# EAGLE design GBA SP Battery Kit (EAGLE 6.2)
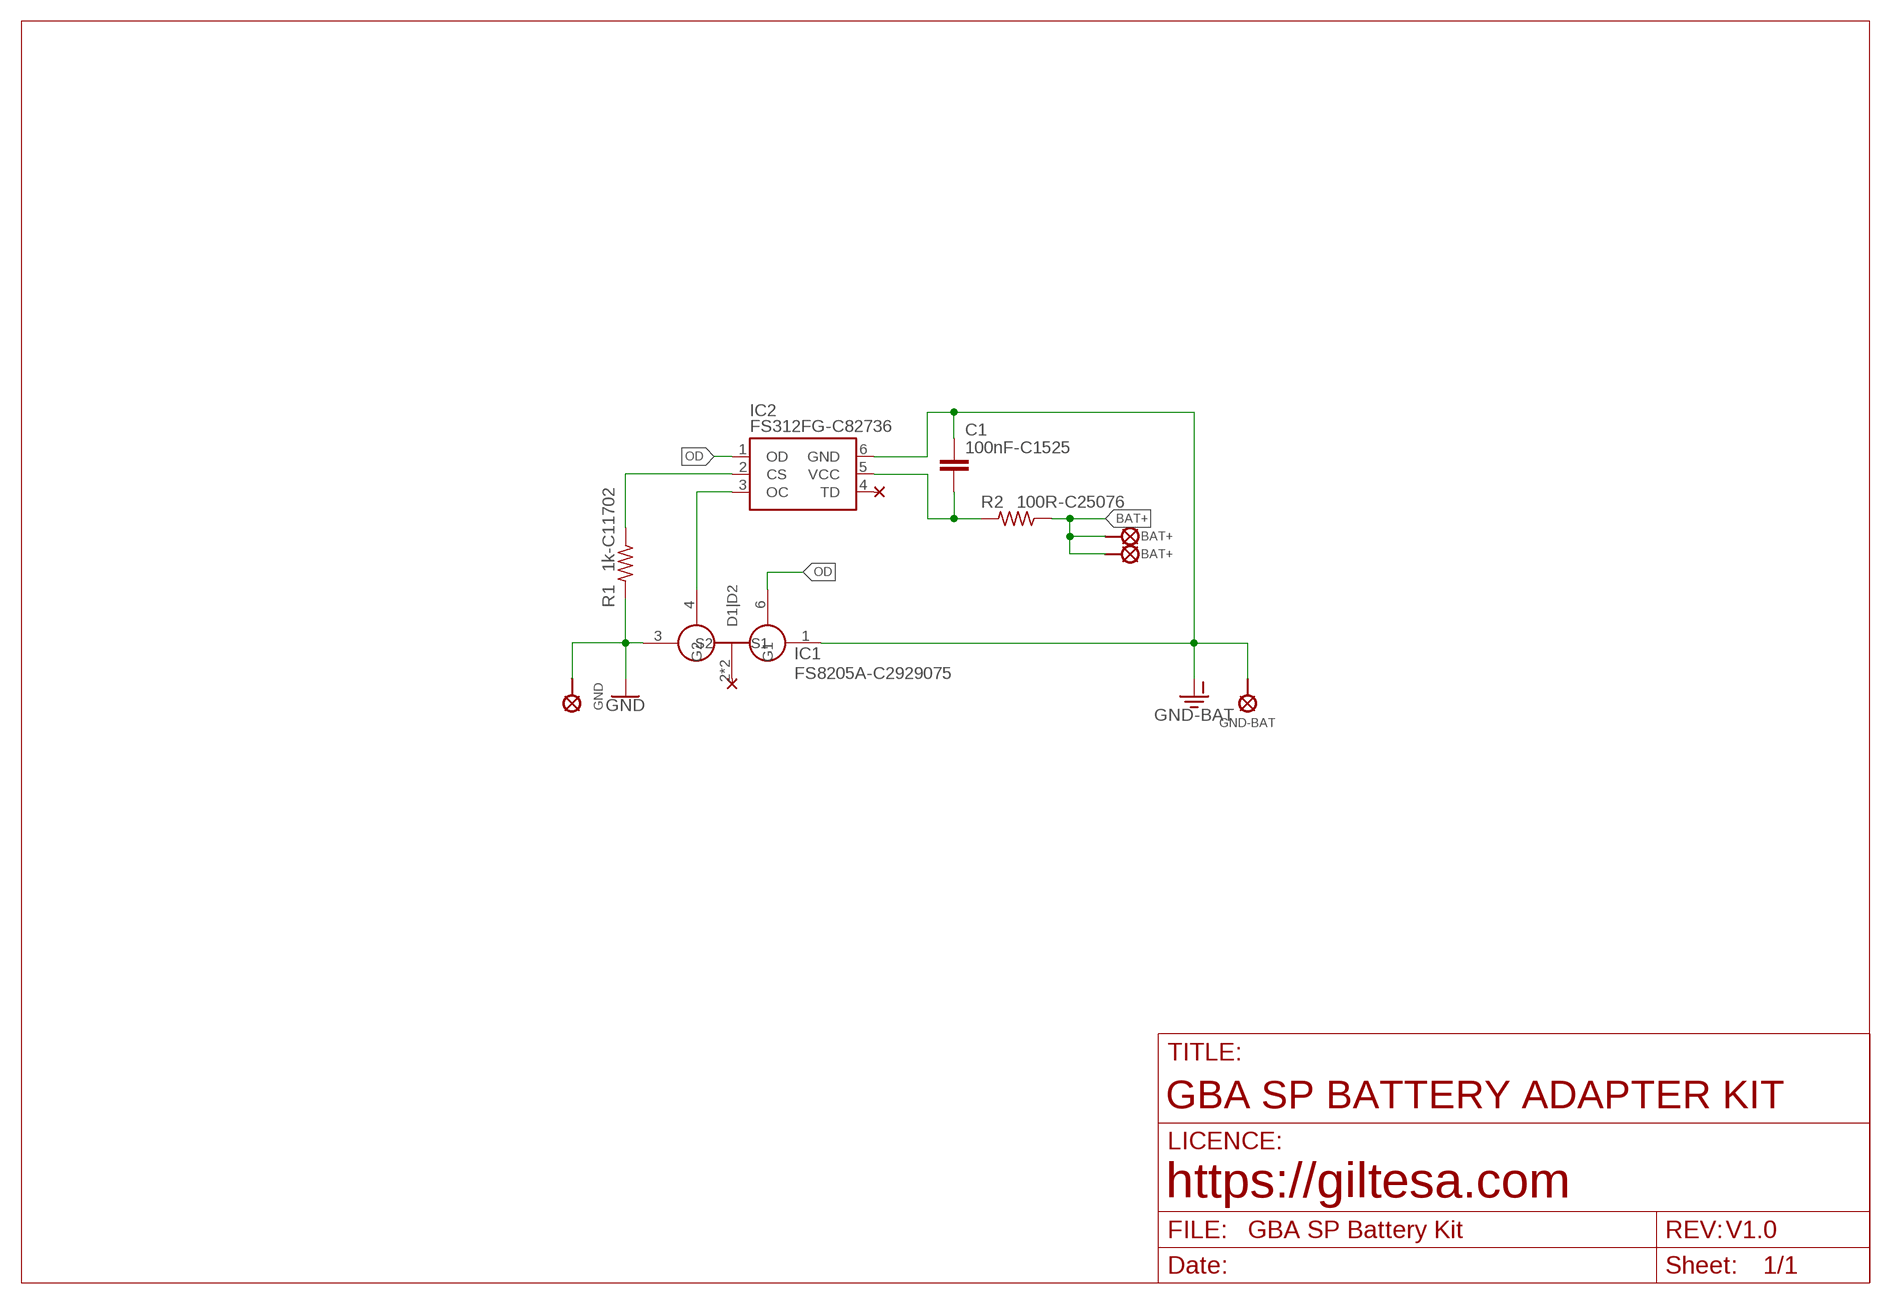
[diagram p0: schematic, sheet 1]

## Parts
C1  100nF-C1525  C0402_S  [C0402_S]
IC1  FS8205A-C2929075  FS8205FS  [SOT-23-6]
IC2  FS312FG-C82736  FS312F-G  [SOT-23-6]
R1  1k-C11702  R0402  [R0402]
R2  100R-C25076  R0402  [R0402]
U$2  BAT+  SOLDER_PADGBASP  [BATTERY_SOLDER_PAD_GBASP]
U$4  GND-BAT  SOLDER_PADGBASP  [BATTERY_SOLDER_PAD_GBASP]
U$5  GND  SOLDER_PADGBASP  [BATTERY_SOLDER_PAD_GBASP]
U$9  BAT+  SOLDER_PADGBASP  [BATTERY_SOLDER_PAD_GBASP]

## Nets
BAT+: R2.1 U$2.1 U$9.1
GND: IC1.3(S2) R1.2 U$5.1
GND-BAT: C1.1 IC1.1(S1) IC2.6(GND) U$4.1
N$1: IC2.2(CS) R1.1
N$2: IC1.4(G2) IC2.3(OC)
OD: IC1.6(G1) IC2.1(OD)
VCC-DW: C1.2 IC2.5(VCC) R2.2
Unconnected: IC1.2(D1|D2) IC1.5(D1|D2) IC2.4(TD)

## Notes on the sheet
- GBA SP BATTERY ADAPTER KIT
- https://giltesa.com
- V1.0

## Library data of the parts
C1 = ,giltesa:C0402
IC1 = ,giltesa:FS8205
IC2 = ,giltesa:FS312F-G
R1 R2 = ,giltesa:R0402
U$2 U$4 U$5 U$9 = ,giltesa:SOLDER_PAD

## Net classes
1 power: width 0.61 mm, drill 0.406 mm, clearance 0.203 mm
2 gnd: width 0.305 mm, drill 0.406 mm, clearance 0.203 mm
3 power usb: width 0.508 mm, drill 0.406 mm, clearance 0.203 mm

## Board
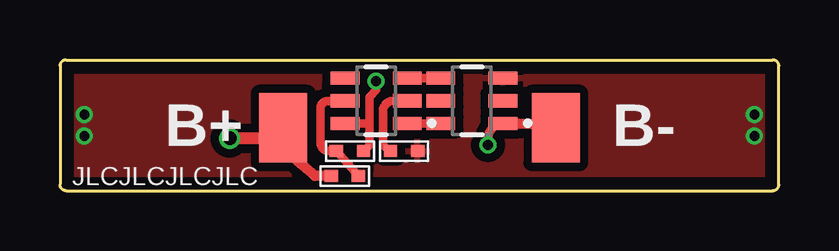
[diagram p1: board, top side]
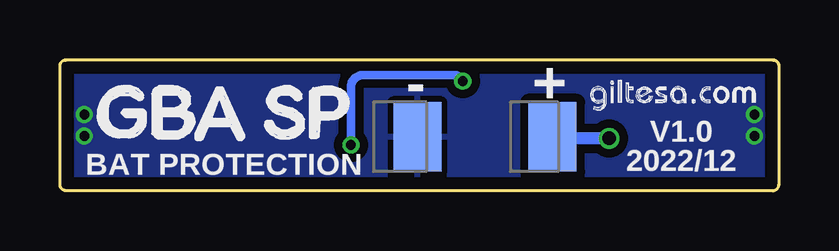
[diagram p2: board, bottom side, seen from below]

Size 29.97 x 5.46 mm. Coordinates in mm from the lower left corner, seen from the top.
Outline: 0.25,0 29.72,0 arc90 29.97,0.25 29.97,5.21 arc90 29.72,5.46 0.25,5.46 arc90 0,5.21 0,0.25 arc90 0.25,0
Copper layers (1*16): Top 0.035mm / dielectric 1.6mm / Bottom 0.035mm
Design rules: minimum track width 6mil, minimum drill 12mil, track to track 6mil, track to pad 6mil, pad to pad 6mil, via to via 8mil, smd to smd 0mil, copper to edge 20mil, drill to drill 10mil, minimum pad ring 6mil, minimum via ring 6mil, stop-mask expansion 0mil, vias tented up to drill 100mil, thermal gap 10mil

### Footprints (pad centres in the part's own frame; a part is rotated, then mirrored left to right if it is on the bottom)
C0402_S = smd 0.559 x 0.5: 1 -0.567,0; 2 0.567,0
SOT-23-6 = smd 0.55 x 1.2: 1 -0.95,-1.3; 2 0,-1.3; 3 0.95,-1.3; 4 0.95,1.3; 5 0,1.3; 6 -0.95,1.3
R0402 = smd 0.559 x 0.5: 1 -0.567,0; 2 0.567,0
BATTERY_SOLDER_PAD_GBASP = smd 2 x 2.9: 1 0,0

### Placement (x,y rotation side)
C1  12.09,1.65 180 top
IC1  17.17,3.75 90 top
IC2  13.18,3.75 90 top
R1  14.35,1.65 0 top
R2  11.87,0.61 0 top
U$2  9.3,2.62 180 top
U$4  20.67,2.62 180 top
U$5  15.07,2.25 0 bottom
U$6  [GAME_BOY_ADVANCE_SP_MINI]  28.45,2.16 0 bottom
U$9  9.44,2.25 0 bottom
U$28  [GILTESA.COM_MASK_7MM]  7.9,3.28 0 bottom

### Tracks (layer width: path | path; a pad name or v marks a point on that pad's centre or on a via)
BAT+  (via drill 0.56)
  Top 0.406: R2.1 10.63,0.61 8.99,2 U$2.1
  Top 0.508: 8.99,2 8.82,2 8.64,2.18 v7.08,2.18
  Bottom 0.508: v7.08,2.18 9.37,2.18 U$9.1
GND  (via drill 0.41)
  other vias: 1.02,3.17 1.02,2.29 28.96,3.17 28.96,2.29
  pour Top (isolate 0.356): -1,6 32.5,6 32.5,-0.5 -1,-0.5
  pour Bottom (isolate 0.356): -1,6 32.5,6 32.5,-0.5 -1,-0.5
GND-BAT  (via drill 0.41)
  Top 0.356: 12.9,2.79 12.9,1.89 C1.1 | IC2.6 12.89,2.8 arc-90 12.9,2.79 | 12.9,2.79 12.9,3.91 13.18,4.19 v13.18,4.57 | v17.84,1.91 17.84,2.17 arc-90 IC1.1
  Top 0.406: IC1.1 20.81,2.8 U$4.1
  Bottom 0.356: v17.84,1.91 17.84,4.32 arc90 17.34,4.83 13.43,4.83 v13.18,4.57
N$1
  Top 0.356: R1.1 13.46,1.89 13.46,3.3 arc-90 13.91,3.75 IC2.2
N$2
  Top 0.356: IC1.4 IC2.3
OD
  Top 0.356: IC1.6 IC2.1
VCC-DW
  Top 0.356: IC2.5 11.18,3.75 arc90 10.86,3.43 10.86,2.03 arc90 11.24,1.65 C1.2 R2.2

### Text on the board
tPlace: B+ | B- | JLCJLCJLCJLC
bPlace: + | - | V1.0 | 2022/12 | BAT PROTECTION